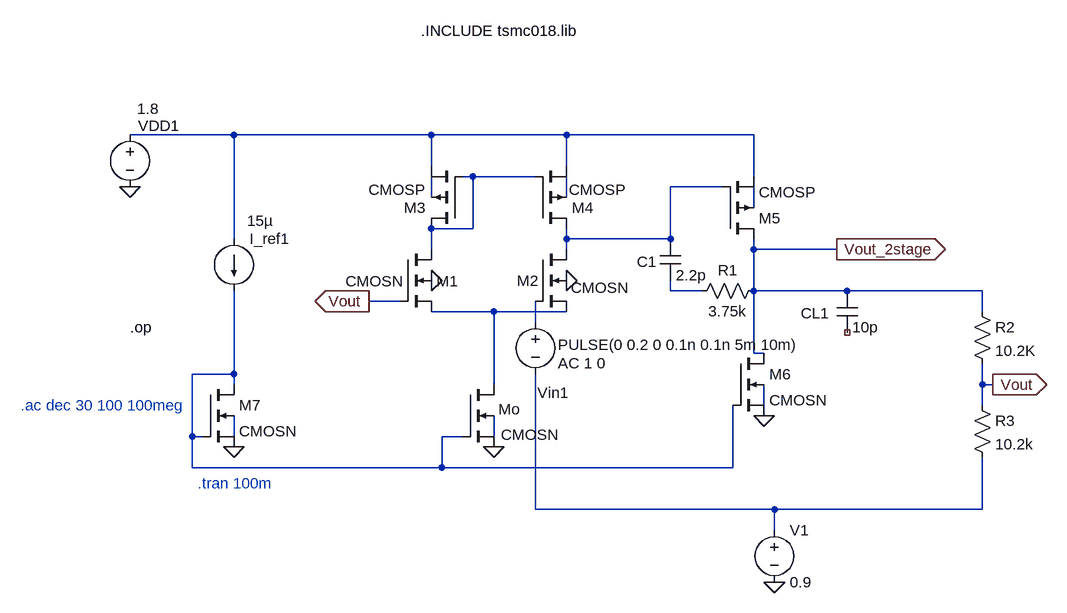
[diagram p0: schematic ota2_pulse_anshuman.asc]
ota2_pulse_anshuman.asc, the LTspice schematic file:
Version 4
SHEET 1 1504 980
WIRE 224 272 64 272
WIRE 528 272 224 272
WIRE 736 272 528 272
WIRE 1024 272 736 272
WIRE 528 320 528 272
WIRE 736 320 736 272
WIRE 592 336 576 336
WIRE 688 336 592 336
WIRE 1024 336 1024 272
WIRE 976 352 896 352
WIRE 528 368 528 336
WIRE 736 368 736 336
WIRE 1024 384 1024 352
WIRE 592 416 592 336
WIRE 592 416 528 416
WIRE 224 432 224 272
WIRE 736 432 736 416
WIRE 896 432 896 352
WIRE 896 432 736 432
WIRE 528 448 528 416
WIRE 736 448 736 432
WIRE 1024 448 1024 432
WIRE 1152 448 1024 448
WIRE 896 512 896 496
WIRE 944 512 896 512
WIRE 1024 512 1024 448
WIRE 1168 512 1024 512
WIRE 1376 512 1168 512
WIRE 480 528 432 528
WIRE 624 544 528 544
WIRE 736 544 624 544
WIRE 1376 544 1376 512
WIRE 688 560 688 528
WIRE 1024 608 1024 512
WIRE 1040 608 1024 608
WIRE 224 640 224 512
WIRE 224 640 160 640
WIRE 224 656 224 640
WIRE 624 656 624 544
WIRE 1376 656 1376 624
WIRE 1392 656 1376 656
WIRE 1040 688 1040 656
WIRE 1376 688 1376 656
WIRE 160 736 160 640
WIRE 176 736 160 736
WIRE 224 736 224 704
WIRE 576 736 544 736
WIRE 624 736 624 704
WIRE 160 784 160 736
WIRE 544 784 544 736
WIRE 544 784 160 784
WIRE 992 784 992 688
WIRE 992 784 544 784
WIRE 688 848 688 640
WIRE 1056 848 688 848
WIRE 1376 848 1376 768
WIRE 1376 848 1056 848
WIRE 1056 880 1056 848
FLAG 64 352 0
FLAG 224 752 0
FLAG 624 752 0
FLAG 1152 448 Vout_2stage
IOPIN 1152 448 Out
FLAG 1040 704 0
FLAG 528 496 0
FLAG 736 496 0
FLAG 432 528 Vout
IOPIN 432 528 Out
FLAG 1392 656 Vout
IOPIN 1392 656 Out
FLAG 1056 960 0
SYMBOL cmosn 480 448 R0
WINDOW 0 56 49 Left 2
WINDOW 3 -84 49 Left 2
SYMATTR InstName M1
SYMATTR Value2 l=0.9u w=4.402u
SYMBOL cmosn 688 448 R0
WINDOW 0 -28 48 Left 2
WINDOW 3 55 59 Left 2
SYMATTR InstName M2
SYMATTR Value2 l=0.9u w=4.402u
SYMBOL cmosp 576 416 R180
WINDOW 3 57 60 Left 2
SYMATTR InstName M3
SYMATTR Value2 l=0.9u w=10.125u
SYMBOL cmosp 688 416 M180
WINDOW 3 52 60 Left 2
SYMATTR InstName M4
SYMATTR Value2 l=0.9u w=10.125u
SYMBOL voltage 64 256 R0
WINDOW 123 0 0 Left 2
WINDOW 39 0 0 Left 2
WINDOW 0 13 2 Left 2
WINDOW 3 11 -24 Left 2
SYMATTR InstName VDD1
SYMATTR Value 1.8
SYMBOL cmosn 576 656 R0
WINDOW 0 55 38 Left 2
WINDOW 3 59 77 Left 2
SYMATTR InstName Mo
SYMATTR Value2 l=0.9u w=8.802u
SYMBOL cmosn 176 656 R0
SYMATTR InstName M7
SYMATTR Value2 l=0.9u w=2.934u
SYMBOL current 224 432 R0
WINDOW 123 0 0 Left 2
WINDOW 39 0 0 Left 2
WINDOW 3 20 -28 Left 2
SYMATTR Value 15µ
SYMATTR InstName I_ref1
SYMBOL cmosp 976 432 M180
SYMATTR InstName M5
SYMATTR Value2 l=0.9u w=6.75u
SYMBOL cmosn 992 608 R0
SYMATTR InstName M6
SYMATTR Value2 l=0.9u w=2.934u
SYMBOL voltage 688 544 R0
WINDOW 123 35 79 Left 2
WINDOW 39 0 0 Left 2
WINDOW 3 35 51 Left 2
WINDOW 0 3 125 Left 2
SYMATTR Value2 AC 1 0
SYMATTR Value PULSE(0 0.2 0 0.1n 0.1n 5m 10m)
SYMATTR InstName Vin1
SYMBOL cap 1152 512 R0
WINDOW 0 -55 34 Left 2
SYMATTR InstName CL1
SYMATTR Value 10p
SYMBOL cap 880 432 R0
WINDOW 0 -36 35 Left 2
SYMATTR InstName C1
SYMATTR Value 2.2p
SYMBOL res 1040 496 R90
WINDOW 0 0 56 VBottom 2
WINDOW 3 32 56 VTop 2
SYMATTR InstName R1
SYMATTR Value 3.75k
SYMBOL res 1360 528 R0
SYMATTR InstName R2
SYMATTR Value 10.2K
SYMBOL res 1360 672 R0
SYMATTR InstName R3
SYMATTR Value 10.2k
SYMBOL voltage 1056 864 R0
WINDOW 123 0 0 Left 0
WINDOW 39 0 0 Left 0
SYMATTR InstName V1
SYMATTR Value 0.9
TEXT -104 688 Left 2 ;.ac dec 30 100 100meg
TEXT 168 808 Left 2 ;.tran 100m
TEXT 512 112 Left 2 !.INCLUDE tsmc018.lib
TEXT 64 568 Left 2 !.op

The netlist it stands for:
* ota2_pulse_anshuman.asc
M1 N002 Vout N008 0 CMOSN l=0.9u w=4.402u
M2 N003 N009 N008 0 CMOSN l=0.9u w=4.402u
M3 N002 N002 N001 N004 CMOSP l=0.9u w=10.125u
M4 N003 N002 N001 N005 CMOSP l=0.9u w=10.125u
VDD1 N001 0 1.8
Mo N008 N010 0 N013 CMOSN l=0.9u w=8.802u
M7 N010 N010 0 N012 CMOSN l=0.9u w=2.934u
I_ref1 N001 N010 15µ
M5 Vout_2stage N003 N001 N006 CMOSP l=0.9u w=6.75u
M6 Vout_2stage N010 0 N011 CMOSN l=0.9u w=2.934u
Vin1 N009 N014 PULSE(0 0.2 0 0.1n 0.1n 5m 10m) AC 1 0
CL1 Vout_2stage NC_01 10p
C1 N003 N007 2.2p
R1 Vout_2stage N007 3.75k
R2 Vout_2stage Vout 10.2K
R3 Vout N014 10.2k
V1 N014 0 0.9
.model NMOS NMOS
.model PMOS PMOS
.lib standard.mos
* .ac dec 30 100 100meg
* .tran 100m
.INCLUDE tsmc018.lib
.op
.backanno
.end